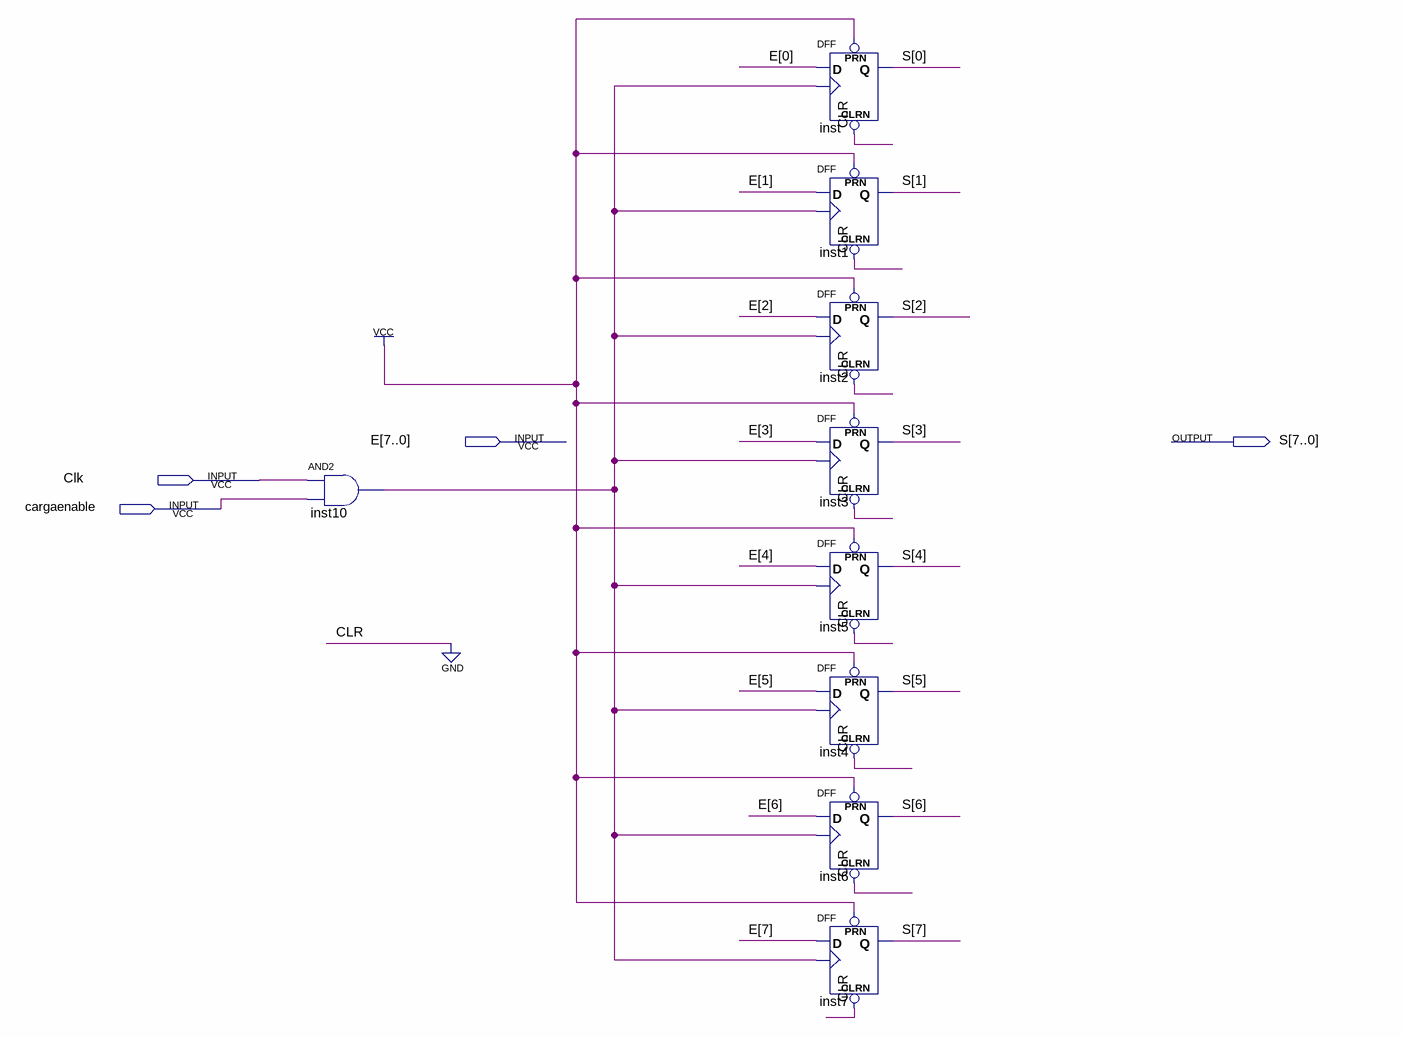
[diagram p0: schematic sheet]
// Quartus schematic SpecReg8b.bdf as structural Verilog: 9 symbols, 4 pins
module SpecReg8b (
  input  [7:0] E,
  input  Clk,
  input  cargaenable,
  output [7:0] S
);

  wire inst10_out;

  and inst10 (inst10_out, Clk, cargaenable);
  DFF inst (.CLRN(1'b0), .CLK(inst10_out), .D(E[0]), .PRN(1'b1), .Q(S[0]));
  DFF inst1 (.CLRN(1'b0), .CLK(inst10_out), .D(E[1]), .PRN(1'b1), .Q(S[1]));
  DFF inst2 (.CLRN(1'b0), .CLK(inst10_out), .D(E[2]), .PRN(1'b1), .Q(S[2]));
  DFF inst3 (.CLRN(1'b0), .CLK(inst10_out), .D(E[3]), .PRN(1'b1), .Q(S[3]));
  DFF inst5 (.CLRN(1'b0), .CLK(inst10_out), .D(E[4]), .PRN(1'b1), .Q(S[4]));
  DFF inst4 (.CLRN(1'b0), .CLK(inst10_out), .D(E[5]), .PRN(1'b1), .Q(S[5]));
  DFF inst6 (.CLRN(1'b0), .CLK(inst10_out), .D(E[6]), .PRN(1'b1), .Q(S[6]));
  DFF inst7 (.CLRN(1'b0), .CLK(inst10_out), .D(E[7]), .PRN(1'b1), .Q(S[7]));
endmodule
